# Altium project C.PrjPCB
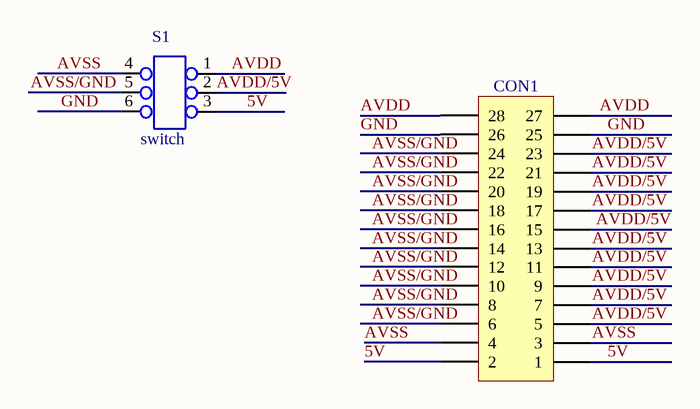
[diagram p0: C.SchDoc]
1 sheet, 2 parts. Net scope: global (net labels, ports and power ports of the same name join across sheets).
Board file: C.PcbDoc

## Sheet C.SchDoc
size A2

### Parts
CON1  SV1  [26]  (value not drawn)
S1  switch  [switch1]

### Nets
5V: CON1.1 CON1.2 S1.3
AVDD: CON1.27 CON1.28 S1.1
AVDD/5V: CON1.5 CON1.7 CON1.9 CON1.11 CON1.13 CON1.15 CON1.17 CON1.19 CON1.21 CON1.23 S1.2
AVSS: CON1.3 CON1.4 S1.4
AVSS/GND: CON1.6 CON1.8 CON1.10 CON1.12 CON1.14 CON1.16 CON1.18 CON1.20 CON1.22 CON1.24 S1.5
GND: CON1.25 CON1.26 S1.6

### Library data of the parts
CON1 = 26
S1 = switch 1